# EAGLE design 1 (EAGLE 6.4)
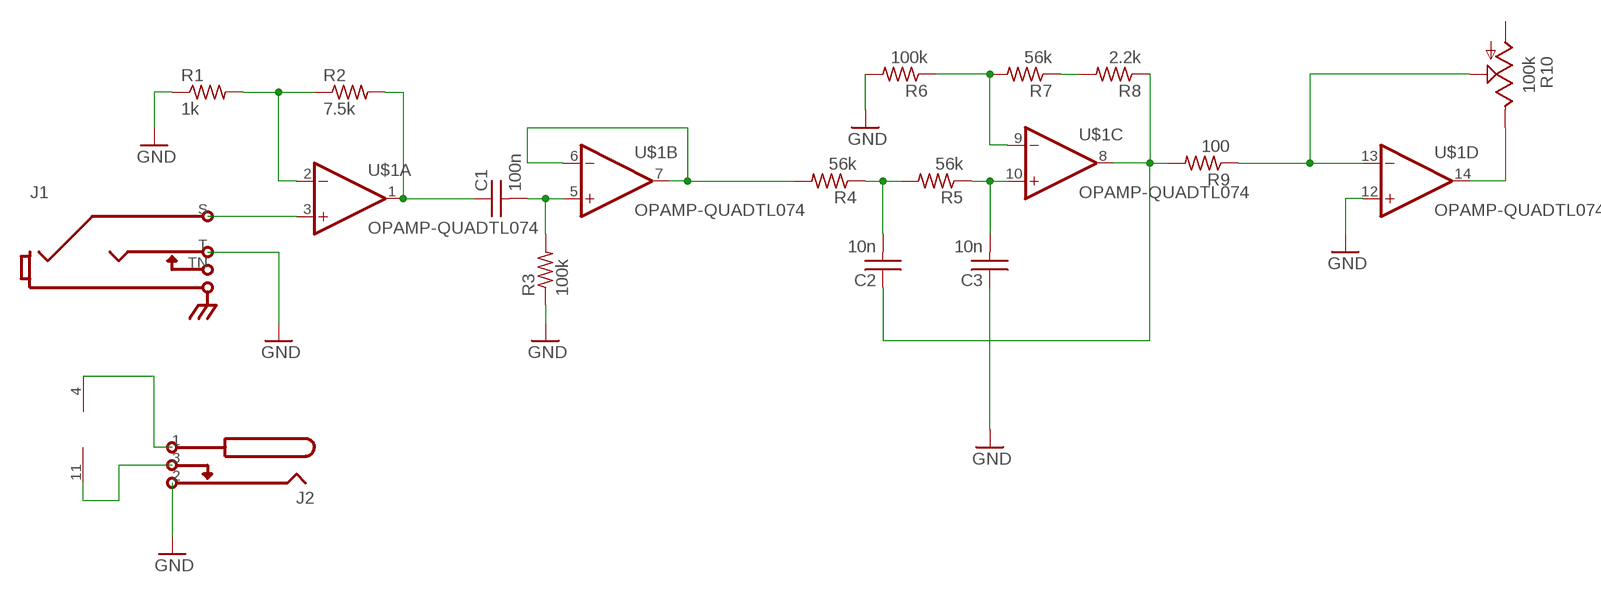
[diagram p0: schematic, sheet 1]

## Parts
C1  100n  CAPACITOR  [BOX-2.5MM-7.2MM]
C2  10n  CAPACITOR  [BOX-2.5MM-7.2MM]
C3  10n  CAPACITOR  [BOX-2.5MM-7.2MM]
J1  MONOSW1GND  [NEUTRIK-NRJ4HM-1]
J2  BOSS-SWITCHING  [KOBICONN-163-5010-E]
R1  1k  RESISTOR0.25W-0.4IN-CARBONCOMP  [0.25W-0.4IN-CARBONCOMP]
R2  7.5k  RESISTOR0.25W-0.4IN-CARBONCOMP  [0.25W-0.4IN-CARBONCOMP]
R3  100k  RESISTOR0.25W-0.4IN-CARBONCOMP  [0.25W-0.4IN-CARBONCOMP]
R4  56k  RESISTOR0.25W-0.4IN-CARBONCOMP  [0.25W-0.4IN-CARBONCOMP]
R5  56k  RESISTOR0.25W-0.4IN-CARBONCOMP  [0.25W-0.4IN-CARBONCOMP]
R6  100k  RESISTOR0.25W-0.4IN-CARBONCOMP  [0.25W-0.4IN-CARBONCOMP]
R7  56k  RESISTOR0.25W-0.4IN-CARBONCOMP  [0.25W-0.4IN-CARBONCOMP]
R8  2.2k  RESISTOR0.25W-0.4IN-CARBONCOMP  [0.25W-0.4IN-CARBONCOMP]
R9  100  RESISTOR0.25W-0.4IN-CARBONCOMP  [0.25W-0.4IN-CARBONCOMP]
R10  100k  POTENTIOMETERHORIZONTAL  [POT-SIDE-16MM-BITECH-P160KN]
U$1  OPAMP-QUADTL074  [DIP14]

## Nets
0: C3.P$1 J1.T J2.2(VCC) R1.1 R3.1 R6.2 U$1.12(D:IN+)
N$1: R1.2 R2.1 U$1.2(A:IN-)
N$2: C1.P$1 R2.2 U$1.1(A:OUT)
N$3: C1.P$2 R3.2 U$1.5(B:IN+)
N$4: R4.2 U$1.6(B:IN-) U$1.7(B:OUT)
N$5: C2.P$2 R4.1 R5.2
N$6: C3.P$2 R5.1 U$1.10(C:IN+)
N$7: R10.P$3 U$1.14(D:OUT)
N$8: R6.1 R7.2 U$1.9(C:IN-)
N$9: R7.1 R8.2
N$10: J1.S U$1.3(A:IN+)
N$11: R9.1 R10.P$2 U$1.13(D:IN-)
N$12: J2.1(GND) U$1.4(SUP:VCC)
N$13: J2.3(SW) U$1.11(SUP:VEE)
N$18: C2.P$1 R8.1 R9.2 U$1.8(C:OUT)
Unconnected: J1.TN R10.P$1

## Library data of the parts
C1-C3 = Capacitors:CAPACITOR: Capacitor; SPICE: C{NAME} {1.NET} {2.NET} {VALUE}
J1 = Audio Jacks 0.25 inch:MONOSW1GND: 1/4" mono jack, switched (unswitched sleeve), with chassis ground connection
J2 = Power Jacks:BOSS-SWITCHING: DC Power Jack, Boss style, switching
R1-R9 = Resistors:RESISTOR: Resistor; SPICE: R{NAME} {1.NET} {2.NET} {VALUE}
R10 = Potentiometers:POTENTIOMETER: Potentiometer; PERCENT: 50; SPICE: R{NAME}CW {3.NET} {2.NET} {{{VALUE} - {{{ATTR.PERCENT} / 100} * {VALUE}}} + 0.001}\nR{NAME}CCW {2.NET} {1.NET} {{{{ATTR.PERCENT} / 100} * {VALUE}} + 0.001}
U$1 = Op Amps:OPAMP-QUAD: Operational amplifier, quad; SPICE: X{NAME}A {A.IN+.NET} {A.IN-.NET} {VCC.NET} {VEE.NET} {A.OUT.NET} TL074\nX{NAME}B {B.IN+.NET} {B.IN-.NET} {VCC.NET} {VEE.NET} {B.OUT.NET} TL074\nX{NAME}C {C.IN+.NET} {C.IN-.NET} {VCC.NET} {VEE.NET} {C.OUT.NET} TL074\nX{NAME}D {D.IN+.NET} {D.IN-.NET} {VCC.NET} {VEE.NET} {D.OUT.NET} TL074; SPICEMOD: .SUBCKT TL074 1 2 3 4 5\nC1 11 12 3.498E-12\nC2 6 7 15.00E-12\nDC 5 53 DX\nDE 54 5 DX\nDLP 90 91 DX\nDLN 92 90 DX\nDP 4 3 DX\nEGND 99 0 POLY(2) (3,0) (4,0) 0 .5 .5\nFB 7 99 POLY(5) VB VC VE VLP VLN 0 4.715E6 -5E6 5E6 5E6 -5E6\nGA 6 0 11 12 282.8E-6\nGCM 0 6 10 99 8.942E-9\nISS 3 10 DC 195.0E-6\nHLIM 90 0 VLIM 1K\nJ1 11 2 10 JX\nJ2 12 1 10 JX\nR2 6 9 100.0E3\nRD1 4 11 3.536E3\nRD2 4 12 3.536E3\nRO1 8 5 150\nRO2 7 99 150\nRP 3 4 2.143E3\nRSS 10 99 1.026E6\nVB 9 0 DC 0\nVC 3 53 DC 2.200\nVE 54 4 DC 2.200\nVLIM 7 8 DC 0\nVLP 91 0 DC 25\nVLN 0 92 DC 25\n.MODEL DX D(IS=800.0E-18)\n.MODEL JX PJF(IS=15.00E-12 BETA=270.1E-6 VTO=-1)\n.ENDS

## Net classes
0 default: width 1.27 mm, drill 0.762 mm, clearance 0.762 mm

## Board
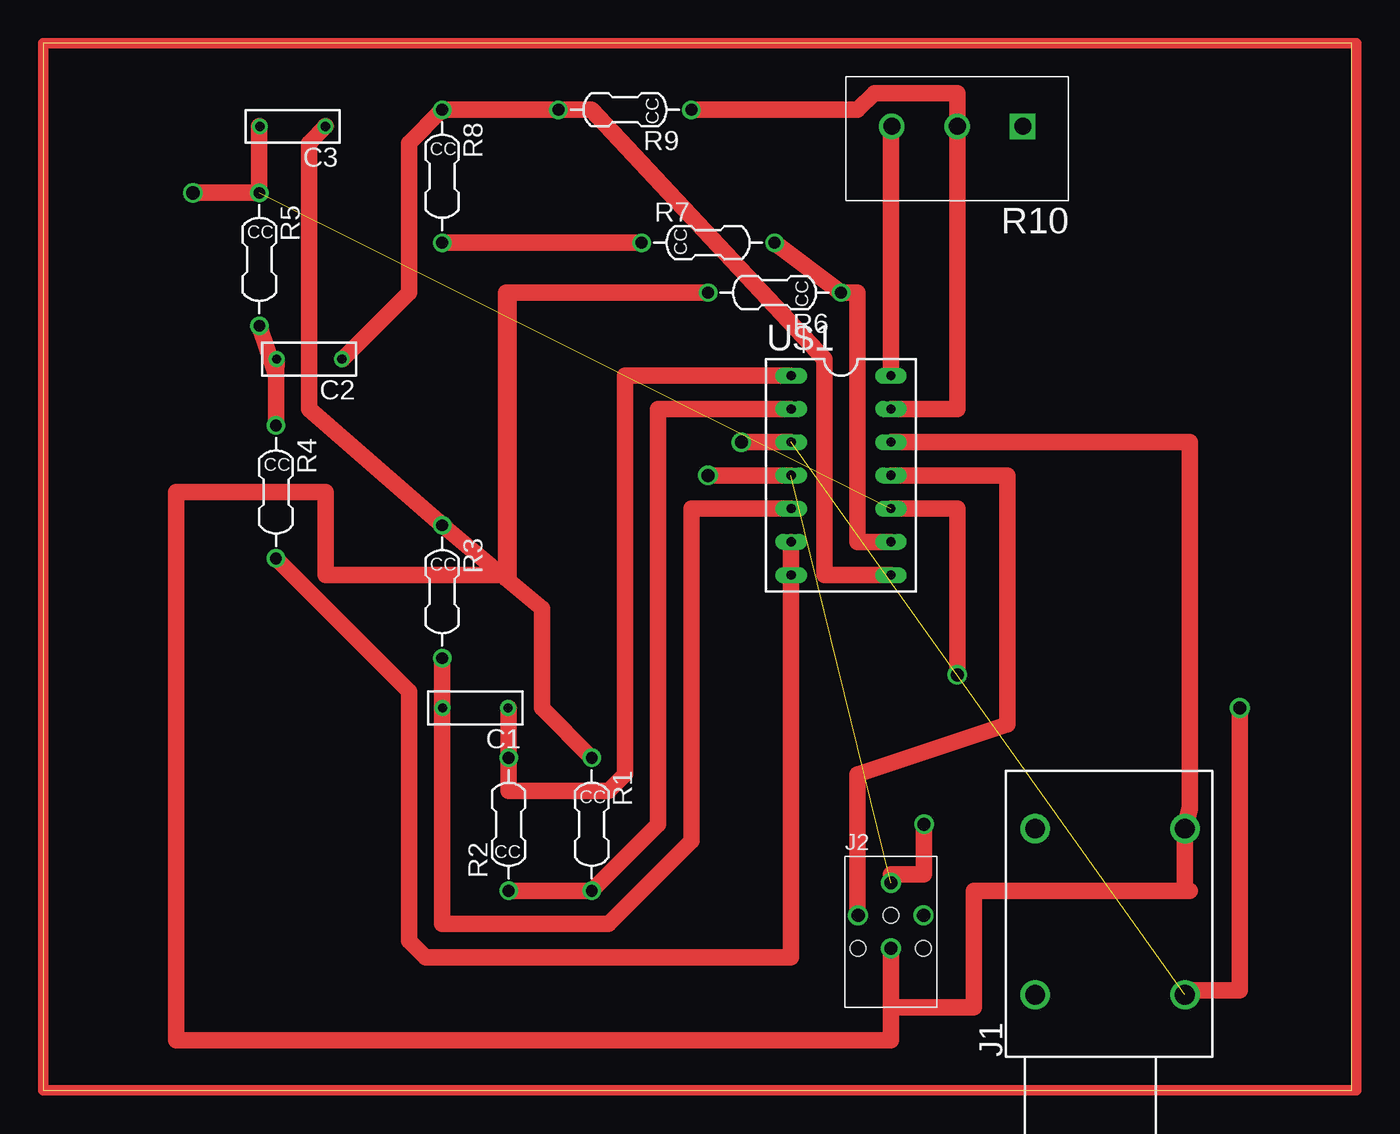
[diagram p1: board, top side]

Size 100 x 80 mm. Coordinates in mm from the lower left corner, seen from the top.
Outline: 0,0 100,0 100,80 0,80 0,0
Copper layers (1*16): Top 0.035mm / dielectric 1.5mm / Bottom 0.035mm
Design rules "default": minimum track width 10mil, minimum drill 24mil, track to track 8mil, track to pad 8mil, pad to pad 8mil, via to via 8mil, smd to smd 8mil, copper to edge 40mil, drill to drill 8mil, minimum pad ring 10mil, minimum via ring 8mil, stop-mask expansion 4mil, vias tented up to drill 0mil, thermal gap 10mil

### Footprints (pad centres in the part's own frame; a part is rotated, then mirrored left to right if it is on the bottom)
BOX-2.5MM-7.2MM = drill 0.7: P$1 -2.5,0; P$2 2.5,0
NEUTRIK-NRJ4HM-1 = drill 1.5: S 7.23,4.75; SN -4.2,4.75; T 7.23,17.45; TN -4.2,17.45
KOBICONN-163-5010-E = drill 1.016: 1 0,9.5; 2 0,4.496; 3 -2.502,7.01; 4 2.502,7.01 | hole 1.194: -2.502,4.496; 2.502,4.496; 0,7.01
0.25W-0.4IN-CARBONCOMP = drill 0.9: 1 -5.08,0; 2 5.08,0
POT-SIDE-16MM-BITECH-P160KN = drill 1.3 square: P$1 -5,3.8 | drill 1.3: P$2 0,3.8; P$3 5,3.8
DIP14 = drill 0.7 long: 1 0,7.62; 2 0,5.08; 3 0,2.54; 4 0,0; 5 0,-2.54; 6 0,-5.08; 7 0,-7.62; 8 7.62,-7.62; 9 7.62,-5.08; 10 7.62,-2.54; 11 7.62,0; 12 7.62,2.54; 13 7.62,5.08; 14 7.62,7.62

### Placement (x,y rotation side)
C1  33.02,29.21 180 top
C2  20.32,55.88 180 top
C3  19.05,73.66 180 top
J1  80.01,2.54 0 top
J2  64.77,6.35 0 top
R1  41.91,20.32 270 top
R2  35.56,20.32 90 top
R3  30.48,38.1 270 top
R4  17.78,45.72 270 top
R5  16.51,63.5 270 top
R6  55.88,60.96 180 top
R7  50.8,64.77 0 top
R8  30.48,69.85 270 top
R9  44.45,74.93 180 top
R10  69.85,77.47 180 top
U$1  57.15,46.99 0 top

### Tracks (layer width: path | path; a pad name or v marks a point on that pad's centre or on a via)
0
  Top 1.27: R1.1 38.1,29.21 38.1,36.83 35.35,39.12 | 35.35,39.12 R3.1 20.32,52.07 20.32,72.39 21.59,73.66 C3.P$1 | U$1.12 87.63,49.53 87.63,21.59 J1.T 87.24,15.24 | 35.35,39.12 35.35,60.96 R6.2 35.56,60.96 35.56,39.37 21.59,39.37 21.59,45.72 10.16,45.72 10.16,3.81 64.77,3.81 64.77,6.35 | J2.2 64.77,6.35 | 64.77,6.35 71.12,6.35 71.12,15.24 87.24,15.24 | 87.63,15.24 87.24,15.24
N$1
  Top 1.27: U$1.2 46.99,52.07 46.99,20.32 R1.2 R2.1
N$2
  Top 1.27: C1.P$1 35.56,29.21 R2.2 35.56,22.86 43.18,22.86 44.45,24.13 44.45,54.61 U$1.1
N$3
  Top 1.27: R3.2 30.48,29.21 | U$1.5 49.53,44.45 49.53,19.05 43.18,12.7 30.48,12.7 30.48,29.21 | 30.48,29.21 C1.P$2
N$4
  Top 1.27: U$1.6 U$1.7 57.15,10.16 29.21,10.16 27.94,11.43 27.94,30.48 R4.2
N$5
  Top 1.27: R5.2 17.78,54.61 | 17.78,54.61 R4.1 | 17.78,54.61 C2.P$2
N$6  (via drill 1)  (1 unrouted)
  Top 1.27: C3.P$2 16.51,73.66 R5.1 v11.43,68.58 | U$1.10 69.85,44.45 v69.85,31.75
N$7
  Top 1.27: U$1.14 64.77,73.66 R10.P$3
N$8
  Top 1.27: R7.2 R6.1 62.23,60.96 62.23,41.91 U$1.9
N$9
  Top 1.27: R7.1 R8.2
N$10  (via drill 1)  (1 unrouted)
  Top 1.27: U$1.3 v53.34,49.53
N$11
  Top 1.27: U$1.13 69.85,52.07 R10.P$2 69.85,76.2 63.5,76.2 62.23,74.93 R9.1
N$12  (via drill 1)  (1 unrouted)
  Top 1.27: U$1.4 v50.8,46.99
N$13
  Top 1.27: U$1.11 73.66,46.99 73.66,27.94 62.23,24.13 62.23,13.97 J2.3
N$15  (via drill 1)
  Top 1.27: 64.77,16.51 67.31,16.51 v67.31,20.32
N$16  (via drill 1)
  Top 1.27: 87.63,7.62 91.44,7.62 v91.44,29.21
N$17
  Top 0.813: 0,80.01 0,0 100.33,0 100.33,80.01 0,80.01
N$18
  Top 1.27: C2.P$1 22.86,55.88 27.94,60.96 27.94,72.39 R8.1 R9.2 41.91,74.93 59.69,55.88 59.69,39.37 U$1.8